# EAGLE design atf ftdi (EAGLE 6.5.0)
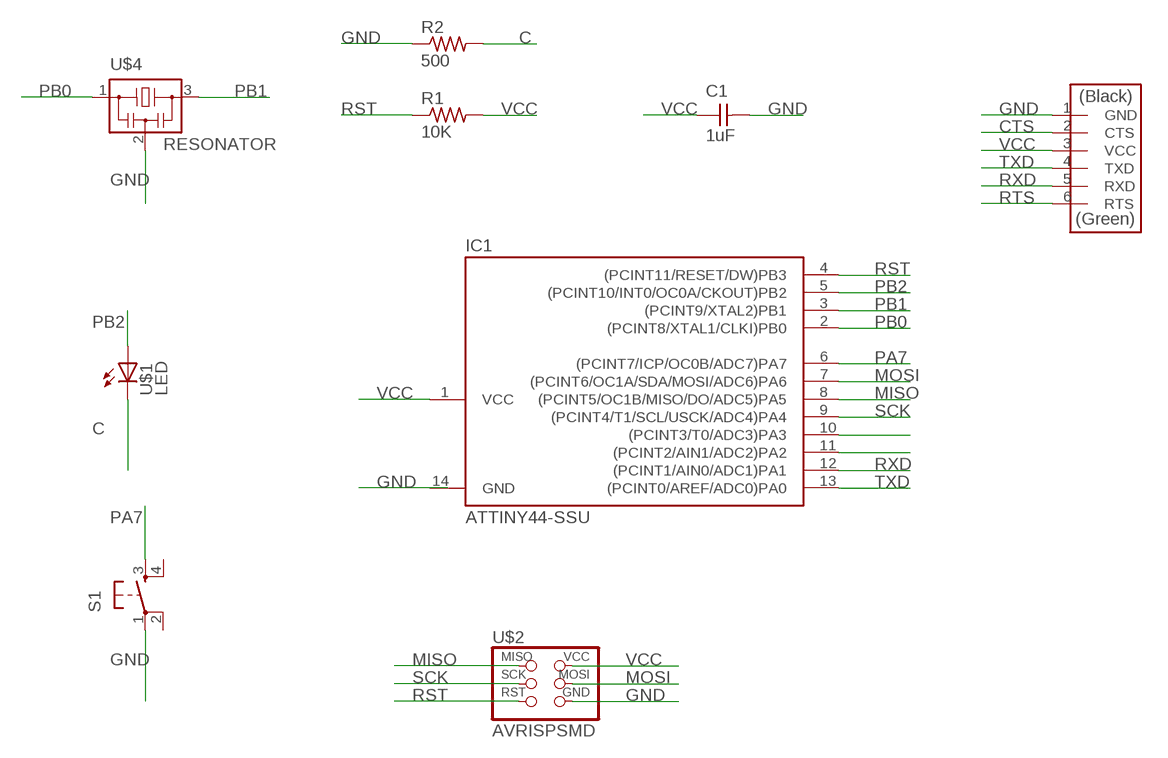
[diagram p0: schematic, sheet 1]

## Parts
C1  1uF  CAP-UNPOLARIZED  [C1206]
IC1  ATTINY44-SSU  [SOIC14]
R1  10K  RES-US1206  [R1206]
R2  500  RES-US1206  [R1206]
S1  6MM_SWITCH6MM_SWITCH  [6MM_SWITCH]
U$1  LED  [LED1206]
U$2  AVRISPSMD  [2X03SMD]
U$3  FTDI-SMD-HEADER  [1X06SMD]
U$4  RESONATOR  [EFOBM]

## Nets
5: IC1.11((PCINT2/AIN1/ADC2)PA2)
C: R2.2 U$1.2(C)
CTS: U$3.2(CTS)
GND: C1.2 R2.1 S1.1(P) U$2.6(GND) U$3.1(GND) U$4.2
MISO: IC1.8((PCINT5/OC1B/MISO/DO/ADC5)PA5) U$2.1(MISO)
MOSI: IC1.7((PCINT6/OC1A/SDA/MOSI/ADC6)PA6) U$2.4(MOSI)
N$16: IC1.10((PCINT3/T0/ADC3)PA3)
PA7: IC1.6((PCINT7/ICP/OC0B/ADC7)PA7) S1.3(S)
PB0: IC1.2((PCINT8/XTAL1/CLKI)PB0) U$4.1
PB1: IC1.3((PCINT9/XTAL2)PB1) U$4.3
PB2: IC1.5((PCINT10/INT0/OC0A/CKOUT)PB2) U$1.1(A)
RST: IC1.4((PCINT11/RESET/DW)PB3) R1.1 U$2.5(RST)
RTS: U$3.6(RTS)
RXD: IC1.12((PCINT1/AIN0/ADC1)PA1) U$3.5(RXD)
SCK: IC1.9((PCINT4/T1/SCL/USCK/ADC4)PA4) U$2.3(SCK)
TXD: IC1.13((PCINT0/AREF/ADC0)PA0) U$3.4(TXD)
VCC: C1.1 IC1.1(VCC) R1.2 U$2.2(VCC) U$3.3(VCC)
Unconnected: S1.2(P1) S1.4(S1)

## Power pins joined to a net without a drawn wire
GND: IC1.14(GND)

## Library data of the parts
C1 = fab:CAP-UNPOLARIZED
IC1 = fab:ATTINY44
R1 R2 = fab:RES-US: Resistor (US Symbol) Variants with postfix FAB are widened to allow the routing of internal traces
S1 = fab:6MM_SWITCH: OMRON SWITCH
U$1 = fab:LED: LED
U$2 = fab:AVRISP
U$3 = fab:FTDI-SMD-HEADER
U$4 = fab:RESONATOR

## Board
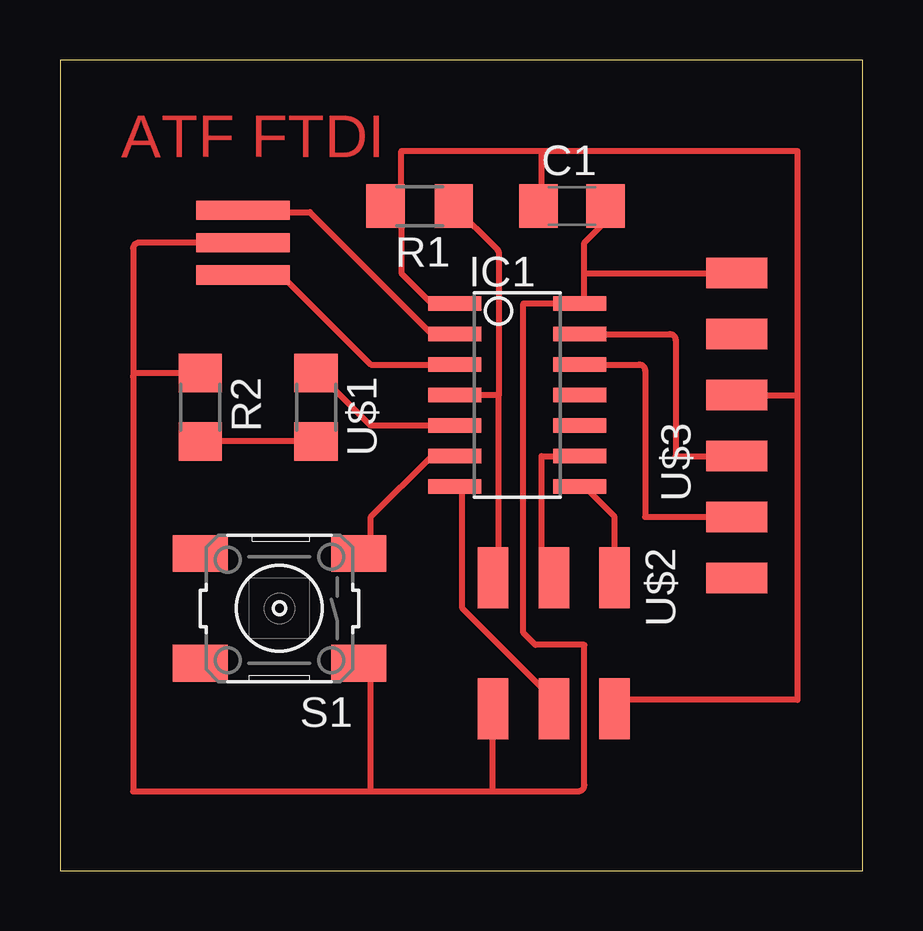
[diagram p1: board, top side]

Size 33.45 x 33.77 mm. Coordinates in mm from the lower left corner, seen from the top.
Outline: 0,0 33.45,0 33.45,33.77 0,33.77 0,0
Copper layers (1*16): Top 0.035mm / dielectric 1.5mm / Bottom 0.035mm
Design rules "default": minimum track width 10mil, minimum drill 24mil, track to track 8mil, track to pad 8mil, pad to pad 8mil, via to via 8mil, smd to smd 8mil, copper to edge 40mil, drill to drill 8mil, minimum pad ring 10mil, minimum via ring 8mil, stop-mask expansion 4mil, vias tented up to drill 0mil, thermal gap 10mil

### Footprints (pad centres in the part's own frame; a part is rotated, then mirrored left to right if it is on the bottom)
C1206 = smd 1.6 x 1.8: 1 -1.4,0; 2 1.4,0
SOIC14 = smd 0.61 x 2.21: 1 -3.81,-2.603; 2 -2.54,-2.603; 3 -1.27,-2.603; 4 0,-2.603; 5 1.27,-2.603; 6 2.54,-2.603; 7 3.81,-2.603; 8 3.81,2.603; 9 2.54,2.603; 10 1.27,2.603; 11 0,2.603; 12 -1.27,2.603; 13 -2.54,2.603; 14 -3.81,2.603
R1206 = smd 1.6 x 1.803: 1 -1.422,0; 2 1.422,0
6MM_SWITCH = smd 2.286 x 1.524: 1 -3.302,2.286; 2 3.302,2.286; 3 -3.302,-2.286; 4 3.302,-2.286
LED1206 = smd 1.6 x 1.803: 1 -1.422,0; 2 1.422,0
2X03SMD = smd 2.54 x 1.27: 1 -2.54,2.54; 2 2.92,2.54; 3 -2.54,0; 4 2.92,0; 5 -2.54,-2.54; 6 2.92,-2.54
1X06SMD = smd 2.54 x 1.27: 1 0,6.35; 2 0,3.81; 3 0,1.27; 4 0,-1.27; 5 0,-3.81; 6 0,-6.35
EFOBM = smd 0.8 x 3.9: 1 -1.35,0; 2 0,0; 3 1.35,0

### Placement (x,y rotation side)
C1  21.34,27.69 0 top
IC1  19.05,19.81 270 top
R1  14.99,27.69 180 top
R2  5.84,19.3 270 top
S1  9.14,10.92 180 top
U$1  10.67,19.3 270 top
U$2  20.57,9.65 270 top
U$3  28.19,18.54 0 top
U$4  7.62,26.16 270 top

### Tracks (layer width: path | path; a pad name or v marks a point on that pad's centre or on a via)
C
  Top 0.254: U$1.2 R2.2
GND
  Top 0.254: U$4.2 3.3,26.16 arc90 3.05,25.91 3.05,20.57 | 3.05,20.57 3.05,3.3 12.95,3.3 | 12.95,3.3 18.03,3.3 | 18.03,3.3 21.59,3.3 arc90 21.84,3.56 21.84,9.4 19.81,9.4 19.3,9.91 19.3,23.62 IC1.14 21.84,23.62 21.84,24.89 | 21.84,24.89 21.84,26.16 23.11,27.43 C1.2 | 12.95,3.3 12.95,8.38 S1.1 | 18.03,3.3 U$2.6 | 21.84,24.89 U$3.1 | R2.1 3.2,20.73 arc90 3.05,20.57
MISO
  Top 0.254: U$2.1 23.11,14.73 21.84,16 IC1.8
MOSI
  Top 0.254: IC1.7 16.76,16 16.76,10.92 20.57,7.11 U$2.4
PA7
  Top 0.254: IC1.6 15.49,17.27 12.95,14.73 12.95,13.46 S1.3
PB0
  Top 0.254: IC1.2 15.49,22.35 10.41,27.43 7.87,27.43 U$4.1
PB1
  Top 0.254: IC1.3 12.95,21.08 9.14,24.89 7.87,24.89 U$4.3
PB2
  Top 0.254: IC1.5 12.95,18.54 10.41,21.08 U$1.1
RST
  Top 0.254: U$2.5 arc90 18.29,12.45 18.29,19.81 | 18.29,19.81 IC1.4 | R1.1 18.21,25.88 arc-45 18.29,25.7 18.29,19.81
RXD
  Top 0.254: IC1.12 24.13,21.08 arc-90 24.38,20.83 24.38,14.73 U$3.5
SCK
  Top 0.254: U$2.3 20.32,12.19 arc-90 20.07,12.45 20.07,17.27 IC1.9
TXD
  Top 0.254: IC1.13 25.4,22.35 arc-90 25.65,22.1 25.65,17.27 U$3.4
VCC
  Top 0.254: 14.22,27.43 14.22,29.97 20.07,29.97 | 19.3,27.43 C1.1 20.57,27.43 20.32,27.43 arc-90 20.07,27.69 20.07,29.97 | 14.22,27.43 14.22,24.89 15.49,23.62 IC1.1 | 14.22,27.43 R1.2 | U$2.2 23.11,7.11 30.73,7.11 30.73,19.81 | 20.07,29.97 30.73,29.97 30.73,19.81 | U$3.3 30.73,19.81

### Text on the board
Top: ATF FTDI